# Altium schematic sheet Connectors.SchDoc
size A4; SheetNumber: 7; SheetTotal: 6
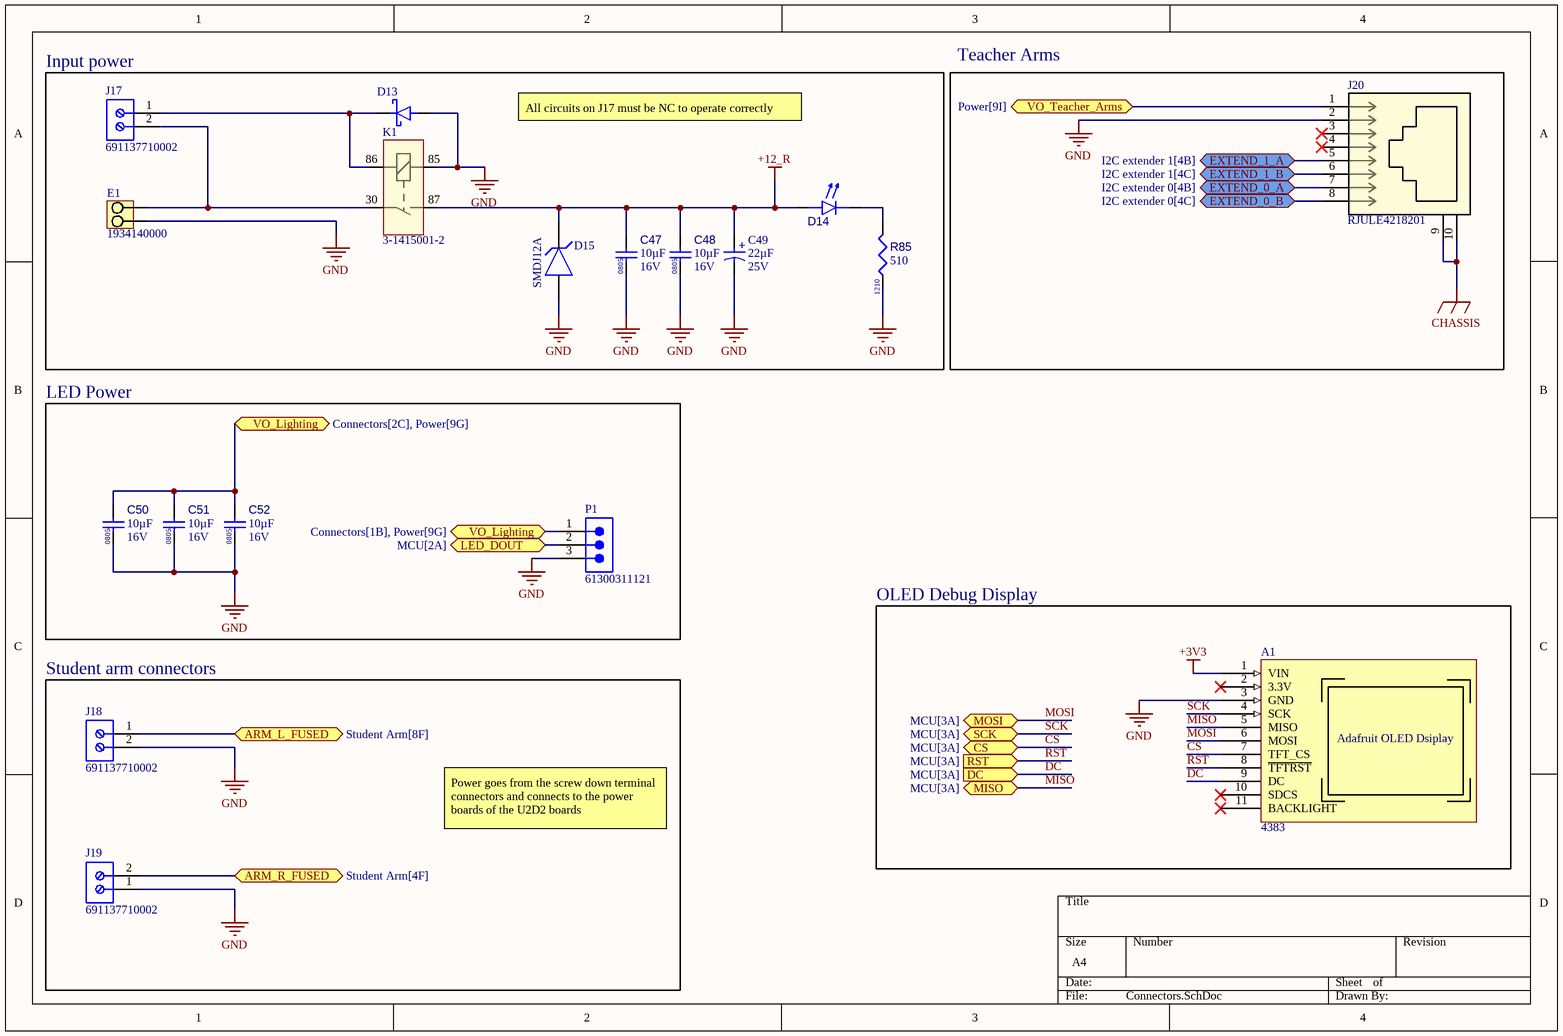
[diagram p0: Connectors.SchDoc]

## Parts
A1  4383  [4383-Footprint-1]
C47  value 10µF  Voltage Rating: 16V  Case/Package: 0805  [CAP CER 10UF 16V X5R 0805-Footprint-1]  (hidden comment: CAP CER 10UF 16V X5R 0805)
C48  value 10µF  Voltage Rating: 16V  Case/Package: 0805  [CAP CER 10UF 16V X5R 0805-Footprint-1]  (hidden comment: CAP CER 10UF 16V X5R 0805)
C49  value 22µF  Voltage Rating: 25V  [WCAP-PSLP_D6.3H5.8]  (hidden comment: 875105544003)
C50  value 10µF  Voltage Rating: 16V  Case/Package: 0805  [CAP CER 10UF 16V X5R 0805-Footprint-1]  (hidden comment: CAP CER 10UF 16V X5R 0805)
C51  value 10µF  Voltage Rating: 16V  Case/Package: 0805  [CAP CER 10UF 16V X5R 0805-Footprint-1]  (hidden comment: CAP CER 10UF 16V X5R 0805)
C52  value 10µF  Voltage Rating: 16V  Case/Package: 0805  [CAP CER 10UF 16V X5R 0805-Footprint-1]  (hidden comment: CAP CER 10UF 16V X5R 0805)
D13  VS-10BQ015-M3/5BT  [FP-95401-MFG]  (value not drawn)
D14  150060RS75000  [WL-SMCW_0603_150060xx75000]  (value not drawn)
D15  SMDJ12A  [FP-DO-214AB_SMC_J-Bend-MFG]
E1  1934140000  [LU_10_16_90_02]
J17  691137710002  [691137710002]
J18  691137710002  [691137710002]
J19  691137710002  [691137710002]
J20  RJULE4218201  [RJULE4218201-Footprint-1]
K1  3-1415001-2  [3-1415001-2-Footprint-1]
P1  61300311121  [61300311121]
R85  value 510  Case/Package: 1210  [RESC3126X60X50NL10T20]  (hidden comment: RC1210JR-07510RL)

## Blocks framed on the sheet
Input power: C47-C49 D13-D15 E1 J17 K1 R85
Teacher Arms: J20
LED Power: C50-C52 P1
OLED Debug Display: A1
Student arm connectors: J18 J19

## Ports
ARM_L_FUSED (bidir, see Student Arm[8F]), ARM_R_FUSED (bidir, see Student Arm[4F]), CS (bidir, see MCU[3A]), DC (in, see MCU[3A]), EXTEND_0_A (bidir, see I2C extender 0[4B]), EXTEND_0_B (bidir, see I2C extender 0[4C]), EXTEND_1_A (bidir, see I2C extender 1[4B]), EXTEND_1_B (bidir, see I2C extender 1[4C]), LED_DOUT (bidir, see MCU[2A]), MISO (bidir, see MCU[3A]), MOSI (bidir, see MCU[3A]), RST (in, see MCU[3A]), SCK (bidir, see MCU[3A]), VO_Lighting (bidir, see Connectors[1B], Power[9G]), VO_Lighting (bidir, see Connectors[2C], Power[9G]), VO_Teacher_Arms (bidir, see Power[9I])

## Nets
+3V3: A1.1(VIN)
+12_R: C47.2 C48.2 C49.1(P) D14.2(A) D15.1(C) K1.87
CHASSIS: J20.9 J20.10
GND: A1.3(GND) C47.1 C48.1 C49.2(N) C50.1 C51.1 C52.1 D13.2(A) D15.2(A) E1.A2 J18.2 J19.1 J20.2 K1.85 P1.3 R85.1
ARM_L_FUSED: J18.1 ; port ARM_L_FUSED
ARM_R_FUSED: J19.2 ; port ARM_R_FUSED
CS: A1.7(TFT_CS) ; port CS
DC: A1.9(DC) ; port DC
EXTEND_0_A: J20.7 ; port EXTEND_0_A
EXTEND_0_B: J20.8 ; port EXTEND_0_B
EXTEND_1_A: J20.5 ; port EXTEND_1_A
EXTEND_1_B: J20.6 ; port EXTEND_1_B
LED_DOUT: P1.2 ; port LED_DOUT
MISO: A1.5(MISO) ; port MISO
MOSI: A1.6(MOSI) ; port MOSI
RST: A1.8(~{TFTRST}) ; port RST
SCK: A1.4(SCK) ; port SCK
VO_Lighting: C50.2 C51.2 C52.2 P1.1 ; port VO_Lighting
VO_Teacher_Arms: J20.1 ; port VO_Teacher_Arms
NetD13_1: D13.1(C) J17.1 K1.86
NetD14_1: D14.1(K) R85.2
NetE1_A1: E1.A1 J17.2 K1.30

Not connected (* = marked no-connect by the designer): A1 2(3.3V)* 10(SDCS)* 11(BACKLIGHT)*; J20 3* 4*

## Notes on the sheet
- All circuits on J17 must be NC to operate correctly
- Power goes from the screw down terminal connectors and connects to the power boards of the U2D2 boards
- (in symbol CMP-001-00085-2) +
- (in symbol CMP-004-000002-4) Adafruit OLED Dsiplay

## Library data of the parts
A1 = CMP-004-000002-4: Adafruit OLED display
C47 C48 C50-C52 = CMP-001-00084-6: Ceramic Capacitor, Multilayer, Ceramic, 16V, 10% +Tol, 10% -Tol, X5R, 15% TC, 10uF, Surface Mount, 0805; Pins: 2; Capacitor Type: Ceramic; Max Operating Temperature: 85°C; Min Operating Temperature: -55°C; RoHS Compliant: Yes; Mounting Technology: Surface Mount
C49 = CMP-001-00085-2: 22 µF 25 V Aluminum - Polymer Capacitors Radial, Can - SMD 30mOhm 2000 Hrs @ 105°C; Tolerance: 20%; Capacitor Type: Aluminium; Pins: 2; RoHS Compliant: Yes
D13 = CMP-004-00041-2: Rectifier Diode, Schottky, 1 Phase, 1 Element, 1A, 15V V(RRM), Silicon; Number of Elements: 1; Package Body Material: Plastic; Non-rep Pk Forward Current-Max: 40A; Forward Voltage: 210mV; Pins: 2; Rep Pk Reverse Voltage-Max: 15V; Min Operating Temperature: -55°C; Surface Mount: Yes; Package Style: SMALL OUTLINEMeter; Max Operating Temperature: 125°C; Max Output current: 1A; JESD-609 Code: e3; Terminal Form: C BEND; JESD-30 Code: R-PDSO-C2; RoHS Compliant: Yes; Reach SVHC Compliant: No; Package Shape: Rectangular; Diode Element Material: SILICON; Terminal Finish: Tin; Moisture Sensitivity Level: 1; Terminal Position: DUAL; Diode Type: RECTIFIER; Technology: SCHOTTKY
D14 = CMP-007-00036-1: Single Color LED, Red, Water Clear, 1.1mm; Forward Current: 30mA; Max Operating Temperature: 85°C; Mounting Technology: Surface Mount; RoHS Compliant: Yes; Pins: 2; Min Operating Temperature: -40°C
D15 = CMP-004-00033-1: Trans Voltage Suppressor Diode, 3000W, 12V V(RWM), Unidirectional, 1 Element, Silicon, DO-214AB; Max Operating Temperature: 150°C; RoHS Compliant: Yes; Min Operating Temperature: -65°C; Pins: 2
E1 = CMP-1560-00480-1: OMNIMATE Power - series LU; Manufacturer: Weidmueller; Solid_max_H05_07_V_U: 16 mm²; Wire_cross_section_AWG_max_UL_1059: AWG 6; Short_text_for_material: LU 10.16/02/90 4.5SN BK BX; Insulating_material: Wemid (PA); Solder_pin_length_mm: 4,5 mm; Side_termination_characteristic: closed side; Wire_cross_section_AWG_min_UL_1059: AWG 26; UL_94_flammability_rating: V-0; Rated_voltage_use_group_B_UL_1059: 300 V; Contact_material: E-Cu; No_of_poles: 2; Rated_voltage_for_surge_voltage_class_pollution_degree_II_2: 1000 V; Pitch_inch: 0,4 inch; Pitch_mm: 10,16 mm; Rated_current_use_group_B_UL_1059: 65 A; Solid_min_H05_07_V_U: 0,5 mm²; Mounting_onto_the_PCB: Solder connection; Contact_surface: tinned; Revision: V1; ComponentLink2Description: URL Link1; Packaging: Box; ComponentLink2URL: http://catalog.weidmueller.com/catalog/Start.do?localeId=en&ObjectID=1934140000; Colour: Black; PackageReference: LU_10_16_90_02; Qty: 20 PCS; ComponentLink1Description: Manufacturer URL; PartNumber: 1934140000; ComponentLink1URL: http://www.weidmueller.com/
J17-J19 = CMP-002-00078-1: Series 1377 - 5.00 mm Horizontal Entry with Pressure Clamp WR-TBL, 2 pin; RoHS Compliant: Yes
J20 = CMP-002-00075-4: Modular Jack - Right Angle, Input Output Connectors RJ45, 8P8C, Without LEDs, Shield.
K1 = CMP-008-00005-1: Power/Signal Relay, SPST, Momentary, 0.13A (Coil), 12VDC (Coil), 1600mW (Coil), 30A (Contact), 24VDC (Contact), DC Input, DC Output, Panel Mount; Reference Standard: UL; Coil Voltage(DC)-Max: 12V; Contact Voltage(DC)-Max: 24V; Coil Current(DC)-Max: 130mA; Body Length or Diameter: 25.9mm; Body Breadth: 25.9inch; Body Height: 24.9mm; Release Time: 2ms; Coil Power: 1.6W; Electrical Life: 100000Cycles; Coil Release Voltage(DC): 1.6V; Coil Operate Voltage(DC): 7.2V; Operate Time: 7ms; Contact DC Max Rating R Load: 30A@24VDC; Sealing: IP54; IP67; RT1; RT3; Coil Resistance: 90R; Min Operating Temperature: -40°C; Mounting Technology: Panel; Termination: Quick Connect; Relay Type: POWER/SIGNAL RELAY; Contact Current(DC)-Max: 30A; Packaging: Box; Reach SVHC Compliant: Yes; RoHS Compliant: Yes; Relay Action: MOMENTARY; Max Operating Temperature: 125°C; Coil/Input Supply Type: DC; Relay Function: SPST; Contact/Output Supply Type: DC
P1 = CMP-002-00076-1: Board Connector, 3 Contact(s), 1 Row(s), Male, Straight, 0.1 inch Pitch, Solder Terminal, Locking, Black Insulator, Plug; Min Operating Temperature: -40°C; Connector Type: BOARD CONNECTOR; RoHS Compliant: Yes; Mounting Technology: Board; Max Operating Temperature: 125°C
R85 = CMP-009-00179-1: Fixed Resistor, Metal Glaze/thick Film, 0.5W, 510ohm, 200V, 5% +/-Tol, 100ppm/Cel, Surface Mount, 1210; Power: 500mW; Pins: 2; Min Operating Temperature: -55°C; Mounting Technology: Surface Mount; Max Operating Temperature: 155°C; RoHS Compliant: Yes; Tolerance: 5%